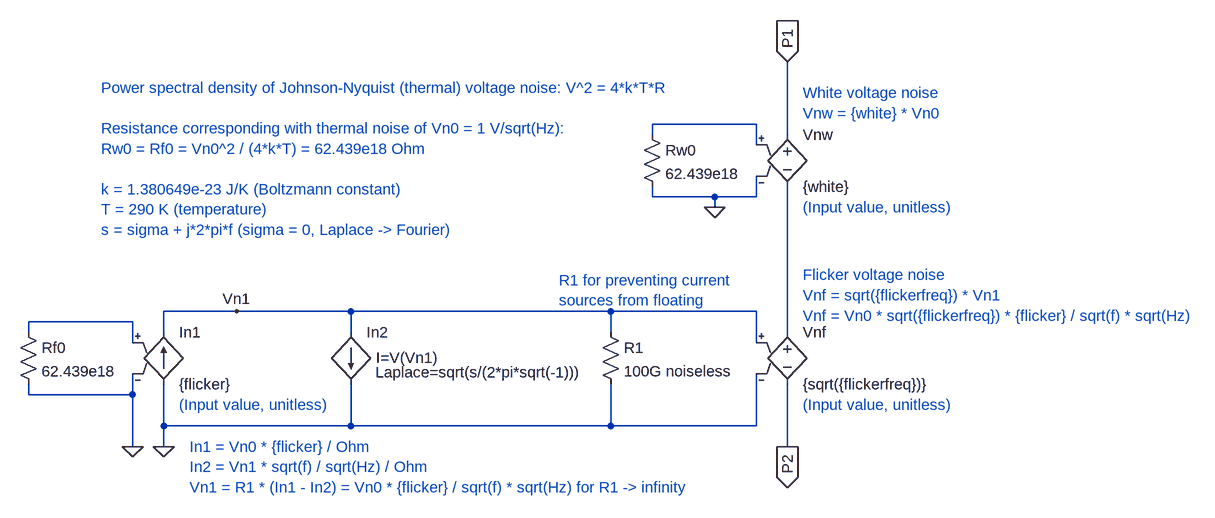
[diagram p0: schematic vnoise.asc]
vnoise.asc, the LTspice schematic file:
Version 4
SHEET 1 4300 1232
WIRE 2144 -1296 1984 -1296
WIRE 1984 -1280 1984 -1296
WIRE 2192 -1280 2192 -1392
WIRE 2144 -1264 2144 -1296
WIRE 1984 -1184 1984 -1200
WIRE 2080 -1184 1984 -1184
WIRE 2144 -1184 2144 -1216
WIRE 2144 -1184 2080 -1184
WIRE 2080 -1168 2080 -1184
WIRE 1344 -1008 1232 -1008
WIRE 1520 -1008 1344 -1008
WIRE 1920 -1008 1520 -1008
WIRE 2144 -1008 1920 -1008
WIRE 1184 -992 1024 -992
WIRE 1024 -976 1024 -992
WIRE 1232 -976 1232 -1008
WIRE 1520 -976 1520 -1008
WIRE 1920 -976 1920 -1008
WIRE 2192 -976 2192 -1200
WIRE 1184 -960 1184 -992
WIRE 2144 -960 2144 -1008
WIRE 1024 -880 1024 -896
WIRE 1184 -880 1184 -912
WIRE 1184 -880 1024 -880
WIRE 1232 -832 1232 -896
WIRE 1520 -832 1520 -896
WIRE 1520 -832 1232 -832
WIRE 1920 -832 1920 -896
WIRE 1920 -832 1520 -832
WIRE 2144 -832 2144 -912
WIRE 2144 -832 1920 -832
WIRE 1184 -800 1184 -880
WIRE 1232 -800 1232 -832
WIRE 2192 -800 2192 -896
FLAG 1344 -1008 Vn1
FLAG 1232 -800 0
FLAG 2080 -1168 0
FLAG 2192 -1392 P1
IOPIN 2192 -1392 In
FLAG 2192 -800 P2
IOPIN 2192 -800 Out
FLAG 1184 -800 0
SYMBOL res 1008 -992 R0
SYMATTR InstName Rf0
SYMATTR Value 62.439e18
SYMBOL e 2192 -992 R0
SYMATTR InstName Vnf
SYMATTR Value {sqrt({flickerfreq})}
SYMBOL bi 1520 -976 R0
WINDOW 3 39 39 Left 2
WINDOW 123 38 62 Left 2
SYMATTR Value I=V(Vn1)
SYMATTR Value2 Laplace=sqrt(s/(2*pi*sqrt(-1)))
SYMATTR InstName In2
SYMBOL res 1968 -1296 R0
SYMATTR InstName Rw0
SYMATTR Value 62.439e18
SYMBOL e 2192 -1296 R0
SYMATTR InstName Vnw
SYMATTR Value {white}
SYMBOL res 1904 -992 R0
SYMATTR InstName R1
SYMATTR Value 100G noiseless
SYMBOL g 1232 -992 R0
SYMATTR InstName In1
SYMATTR Value {flicker}
TEXT 1136 -1352 Left 2 ;Power spectral density of Johnson-Nyquist (thermal) voltage noise: V^2 = 4*k*T*R\n \nResistance corresponding with thermal noise of Vn0 = 1 V/sqrt(Hz):\nRw0 = Rf0 = Vn0^2 / (4*k*T) = 62.439e18 Ohm\n \nk = 1.380649e-23 J/K (Boltzmann constant)\nT = 290 K (temperature)\ns = sigma + j*2*pi*f (sigma = 0, Laplace -> Fourier)
TEXT 2216 -1344 Left 2 ;White voltage noise\nVnw = {white} * Vn0
TEXT 2216 -1168 Left 2 ;(Input value, unitless)
TEXT 1272 -800 Left 2 ;In1 = Vn0 * {flicker} / Ohm\nIn2 = Vn1 * sqrt(f) / sqrt(Hz) / Ohm\nVn1 = R1 * (In1 - In2) = Vn0 * {flicker} / sqrt(f) * sqrt(Hz) for R1 -> infinity
TEXT 1256 -864 Left 2 ;(Input value, unitless)
TEXT 2216 -1064 Left 2 ;Flicker voltage noise\nVnf = sqrt({flickerfreq}) * Vn1\nVnf = Vn0 * sqrt({flickerfreq}) * {flicker} / sqrt(f) * sqrt(Hz)
TEXT 2216 -864 Left 2 ;(Input value, unitless)
TEXT 1840 -1056 Left 2 ;R1 for preventing current\nsources from floating

The netlist it stands for:
* vnoise.asc
Rf0 N002 0 62.439e18
E§Vnf N003 P2 Vn1 0 {sqrt({flickerfreq})}
B§In2 Vn1 0 I=V(Vn1) Laplace=sqrt(s/(2*pi*sqrt(-1)))
Rw0 N001 0 62.439e18
E§Vnw P1 N003 N001 0 {white}
R1 Vn1 0 100G noiseless
G§In1 0 Vn1 N002 0 {flicker}
* Power spectral density of Johnson-Nyquist (thermal) voltage noise: V^2 = 4*k*T*R
* Resistance corresponding with thermal noise of Vn0 = 1 V/sqrt(Hz):
* Rw0 = Rf0 = Vn0^2 / (4*k*T) = 62.439e18 Ohm
* k = 1.380649e-23 J/K (Boltzmann constant)
* T = 290 K (temperature)
* s = sigma + j*2*pi*f (sigma = 0, Laplace -> Fourier)
* White voltage noise
* Vnw = {white} * Vn0
* (Input value, unitless)
* In1 = Vn0 * {flicker} / Ohm
* In2 = Vn1 * sqrt(f) / sqrt(Hz) / Ohm
* Vn1 = R1 * (In1 - In2) = Vn0 * {flicker} / sqrt(f) * sqrt(Hz) for R1 -> infinity
* (Input value, unitless)
* Flicker voltage noise
* Vnf = sqrt({flickerfreq}) * Vn1
* Vnf = Vn0 * sqrt({flickerfreq}) * {flicker} / sqrt(f) * sqrt(Hz)
* (Input value, unitless)
* R1 for preventing current
* sources from floating
.backanno
.end